# EAGLE design GiGaMega_uneversal_1 (EAGLE 7.1.0)

## Sheet 1 of 2
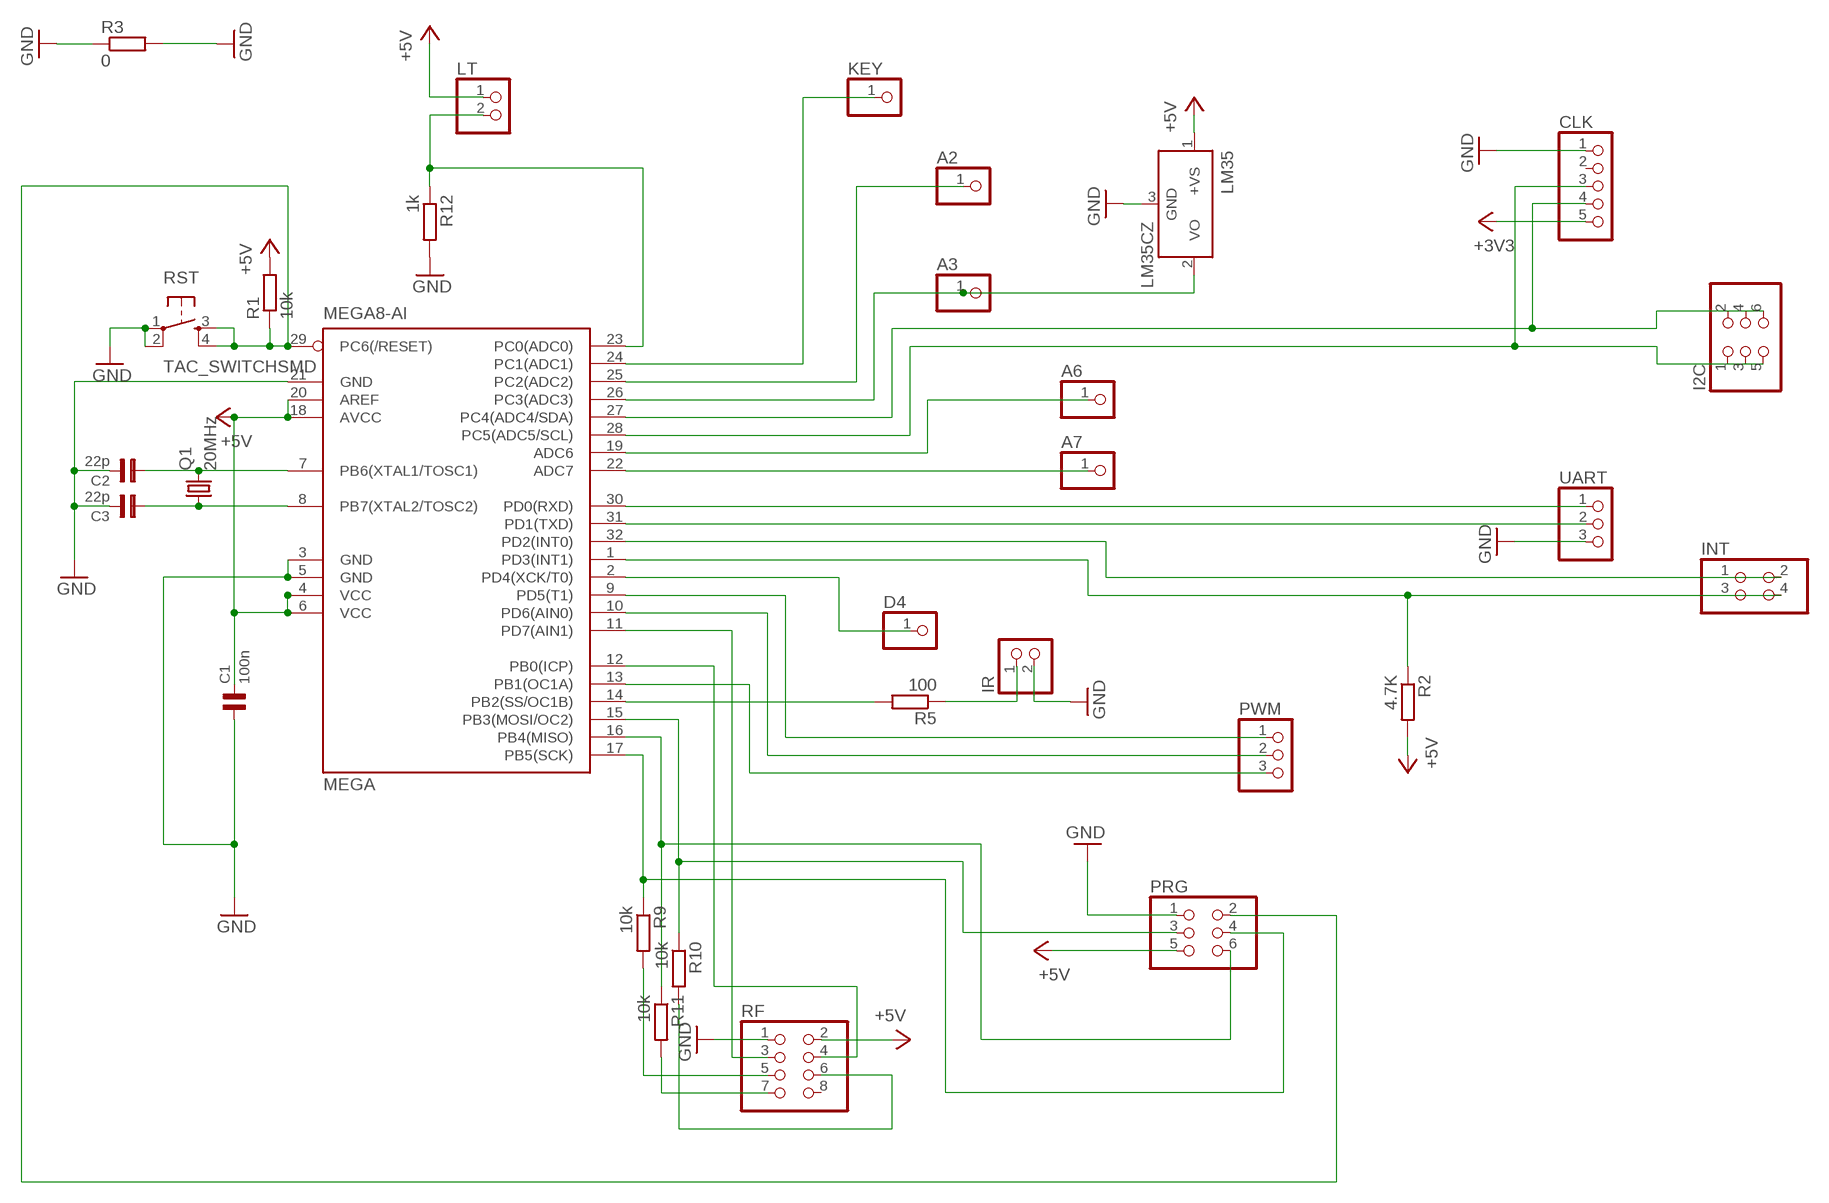
[diagram p0: schematic, sheet 1]

### Parts
A2  PINHD-1X1  [1X01]
A3  PINHD-1X1  [1X01]
A6  PINHD-1X1  [1X01]
A7  PINHD-1X1  [1X01]
C1  100n  C1206  [1206]
C2  22p  C1206  [1206]
C3  22p  C1206  [1206]
CLK  PINHD-1X5  [1X05]
D4  PINHD-1X1  [1X01]
I2C  PINHD-2X3  [2X03]
INT  PINHD-2X2  [2X02]
IR  PINHD-1X2  [1X02]
KEY  PINHD-1X1  [1X01]
LM35  LM35CZ  [TO92]
LT  PINHD-1X2  [1X02]
MEGA  MEGA8-AI  [TQFP32-08]
PRG  PINHD-2X3  [2X03]
PWM  PINHD-1X3  [1X03]
Q1  20MHz  CRYSTALHC49UP  [HC49UP]
R1  10k  R-EU_R1206  [R1206]
R2  4.7K  R-EU_R1206  [R1206]
R3  0  R-EU_R1206  [R1206]
R5  100  R-EU_R1206  [R1206]
R9  10k  R-EU_R1206  [R1206]
R10  10k  R-EU_R1206  [R1206]
R11  10k  R-EU_R1206  [R1206]
R12  1k  R-EU_R1206  [R1206]
RF  PINHD-2X4  [2X04]
RST  TAC_SWITCHSMD  [TACTILE-SWITCH-SMD]
UART  PINHD-1X3  [1X03]

### Nets
+3V3: CLK.5 ; also sheet 2
+5V: C1.2 LM35.1(+VS) LT.1 MEGA.4(VCC) MEGA.6(VCC) MEGA.18(AVCC) MEGA.20(AREF) PRG.5 R1.2 R2.2 RF.2 ; also sheet 2
GND: C1.1 C2.2 C3.2 CLK.1 IR.2 LM35.3(GND) MEGA.3(GND) MEGA.5(GND) MEGA.21(GND) PRG.1 R3.1 R3.2 R12.2 RF.1 RST.1 RST.2 UART.3 ; also sheet 2
KEY_PIN24: KEY.1 MEGA.24(PC1(ADC1))
MISO: MEGA.16(PB4(MISO)) PRG.6 R11.1
MOSI: MEGA.15(PB3(MOSI/OC2)) PRG.3 R10.1
N$1: A2.1 MEGA.25(PC2(ADC2))
N$2: D4.1 MEGA.2(PD4(XCK/T0))
N$4: INT.3 INT.4 MEGA.1(PD3(INT1)) R2.1
N$24: R10.2 RF.6
N$25: R11.2 RF.7
N$30: R9.2 RF.5
PIN1_IRLED: IR.1 R5.1
PIN2: MEGA.9(PD5(T1)) PWM.1
PIN7: C2.1 MEGA.7(PB6(XTAL1/TOSC1)) Q1.2
PIN8: C3.1 MEGA.8(PB7(XTAL2/TOSC2)) Q1.1
PIN9: MEGA.10(PD6(AIN0)) PWM.2
PIN10: MEGA.13(PB1(OC1A)) PWM.3
PIN11: MEGA.11(PD7(AIN1)) RF.3
PIN12: MEGA.12(PB0(ICP)) RF.4
PIN14: MEGA.14(PB2(SS/OC1B)) R5.2
PIN19: A6.1 MEGA.19(ADC6)
PIN22: A7.1 MEGA.22(ADC7)
PIN23: LT.2 MEGA.23(PC0(ADC0)) R12.1
PIR_: A3.1 LM35.2(VO) MEGA.26(PC3(ADC3))
PIR_WATER: INT.1 INT.2 MEGA.32(PD2(INT0))
RESET: MEGA.29(PC6(/RESET)) PRG.2 R1.1 RST.3 RST.4
RX: MEGA.30(PD0(RXD)) UART.1
SCK: MEGA.17(PB5(SCK)) PRG.4 R9.1
SCL: CLK.3 I2C.1 I2C.3 I2C.5 MEGA.28(PC5(ADC5/SCL))
SDA: CLK.4 I2C.2 I2C.4 I2C.6 MEGA.27(PC4(ADC4/SDA))
TX: MEGA.31(PD1(TXD)) UART.2
Unconnected: CLK.2 RF.8

## Sheet 2 of 2
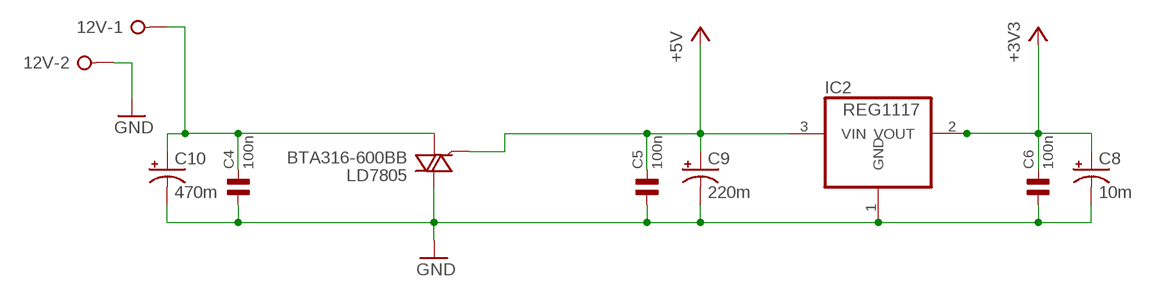
[diagram p1: schematic, sheet 2]

### Parts
12V  W237-02P  [W237-132]
C4  100n  C1206  [1206]
C5  100n  C1206  [1206]
C6  100n  C1206  [1206]
C8  10m  CPOL-USUD-4X5,8  [UD-4X5,8_NICHICON]
C9  220m  CPOL-USUD-6,3X7,7  [UD-6,3X7,7_NICHICON]
C10  470m  CPOL-USUD-10X10  [UD-10X10_NICHICON]
IC2  REG1117  [SOT223]
LD7805  BTA316-600BB  [SOT404]

### Nets
+3V3: C6.2 C8.+ IC2.2(VOUT) ; also sheet 1
+5V: C5.2 C9.+ IC2.3(VIN) LD7805.3(G) ; also sheet 1
+12: 12V.1 C4.2 C10.+ LD7805.1(CM)
GND: 12V.2 C4.1 C5.1 C6.1 C8.- C9.- C10.- IC2.1(GND) LD7805.MB(LD) ; also sheet 1

## Library data of the parts
12V = con-wago-508:W237-02P: WAGO SREW CLAMP; OC_FARNELL: unknown; OC_NEWARK: unknown
A2 A3 A6 A7 D4 KEY = pinhead:PINHD-1X1: PIN HEADER
C1-C6 = capsmd:C1206
C8-C10 = rcl:CPOL-US: POLARIZED CAPACITOR, American symbol
CLK = pinhead:PINHD-1X5: PIN HEADER
I2C PRG = pinhead:PINHD-2X3: PIN HEADER
IC2 = burr-brown:REG1117: 800mA and 1A Low Dropout (LDO) Positive Regulator 1.8V, 2.5V, 2.85V, 3.3V, 5V, and Adj; MPN: REG1117; OC_FARNELL: 1097566; OC_NEWARK: 14P6981
INT = pinhead:PINHD-2X2: PIN HEADER
IR LT = pinhead:PINHD-1X2: PIN HEADER
LD7805 = nxp_60:BTA316: Planar passivated high commutation three quadrant triac in a SOT78 plastic package intended for use in circuits where high static and dynamic dV/dt and high dI/dt can occur AAL Eindhoven MV+ MK; 12NC: 9340 601 04118
LM35 = lm35:LM35: Single-Supply Centigrade Temperature Sensor Vout = (10mV/°C x Temp °C) +5mmmV Source: http://www.national.com/ds/LM/LM35.pdf
MEGA = atmel:MEGA8: MICROCONTROLLER 8 Kbytes FLASH, 1 kbytes SRAM, 512 bytes EEPROM, USART, 6-channel 10 bit ADC, 2-channel 8 bit ADC Pin compatible with Atmega48, ATMega88, ATMega168 Source: avr.lbr; MPN: ATMEGA8-16AU; OC_FARNELL: 9171371; OC_NEWARK: 73M8863
PWM UART = pinhead:PINHD-1X3: PIN HEADER
Q1 = crystal:CRYSTAL: CRYSTAL; OC_FARNELL: unknown; OC_NEWARK: unknown
R1-R3 R5 R9-R12 = rcl:R-EU_: RESISTOR, European symbol
RF = pinhead:PINHD-2X4: PIN HEADER
RST = SparkFun-Retired:TAC_SWITCH: Momentary Switch Button commonly used for reset or general input. Spark Fun Electronics SKU : COM-00097 SMT- SWCH-08247; PROD_ID: SWCH-08247

## Board
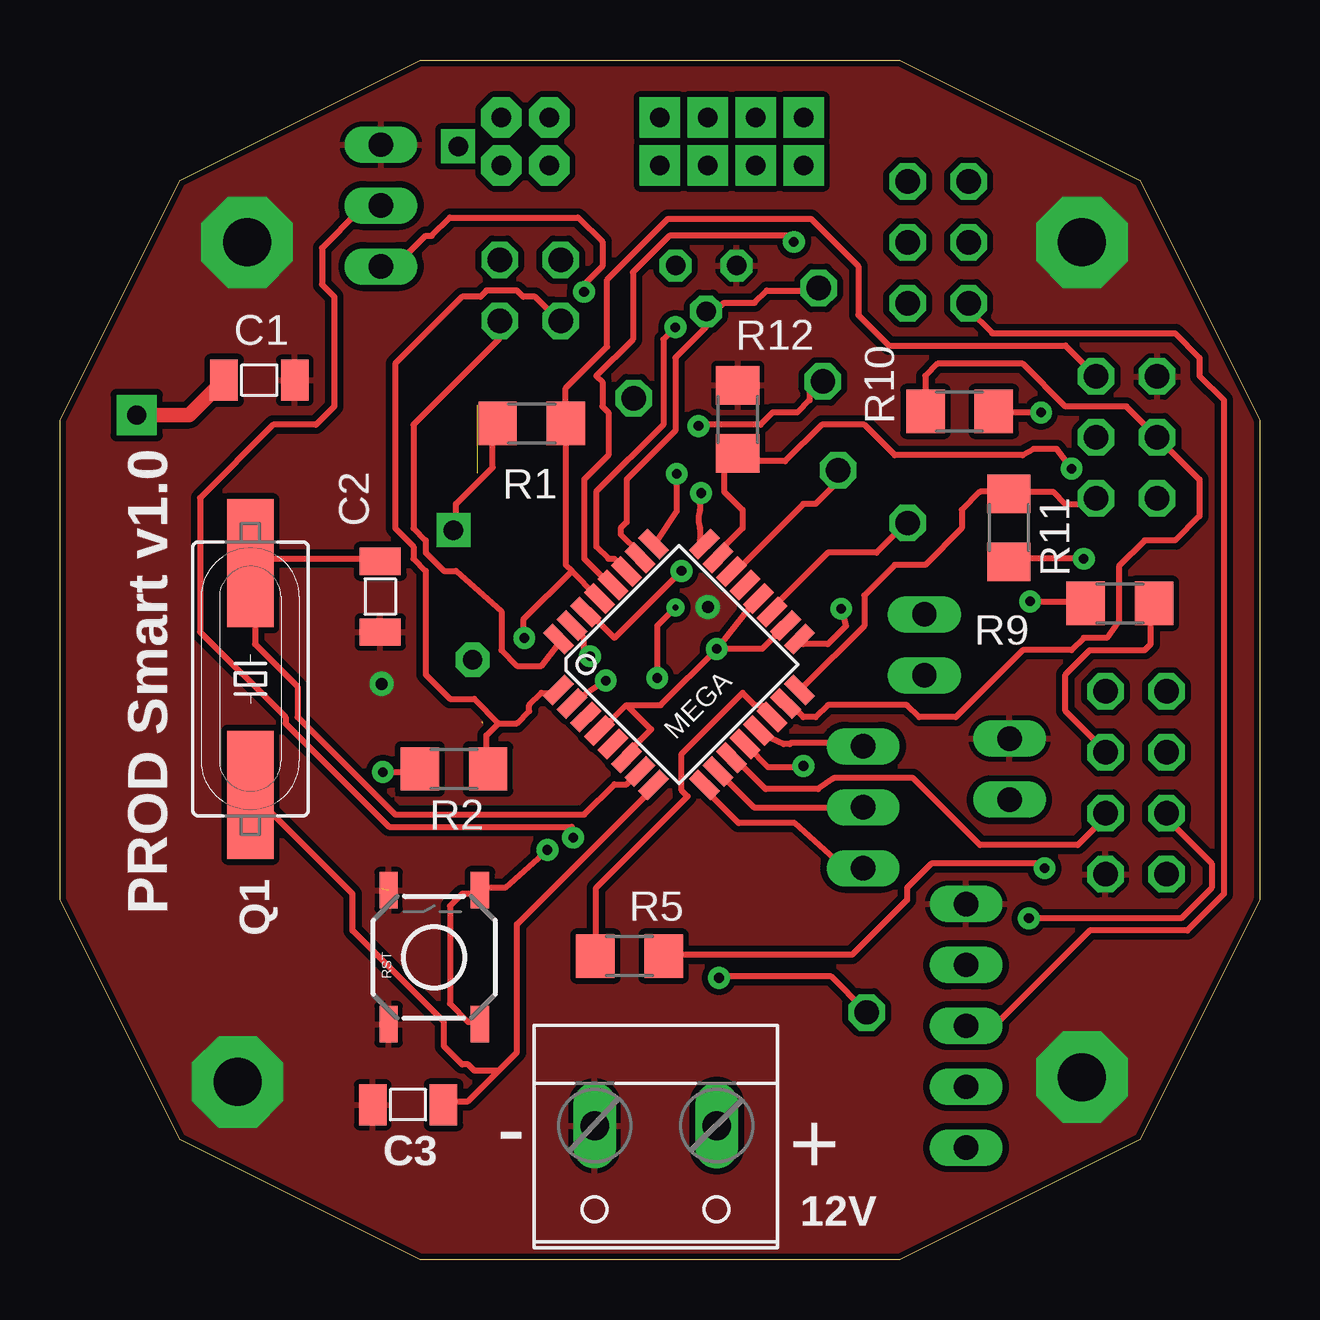
[diagram p2: board, top side]
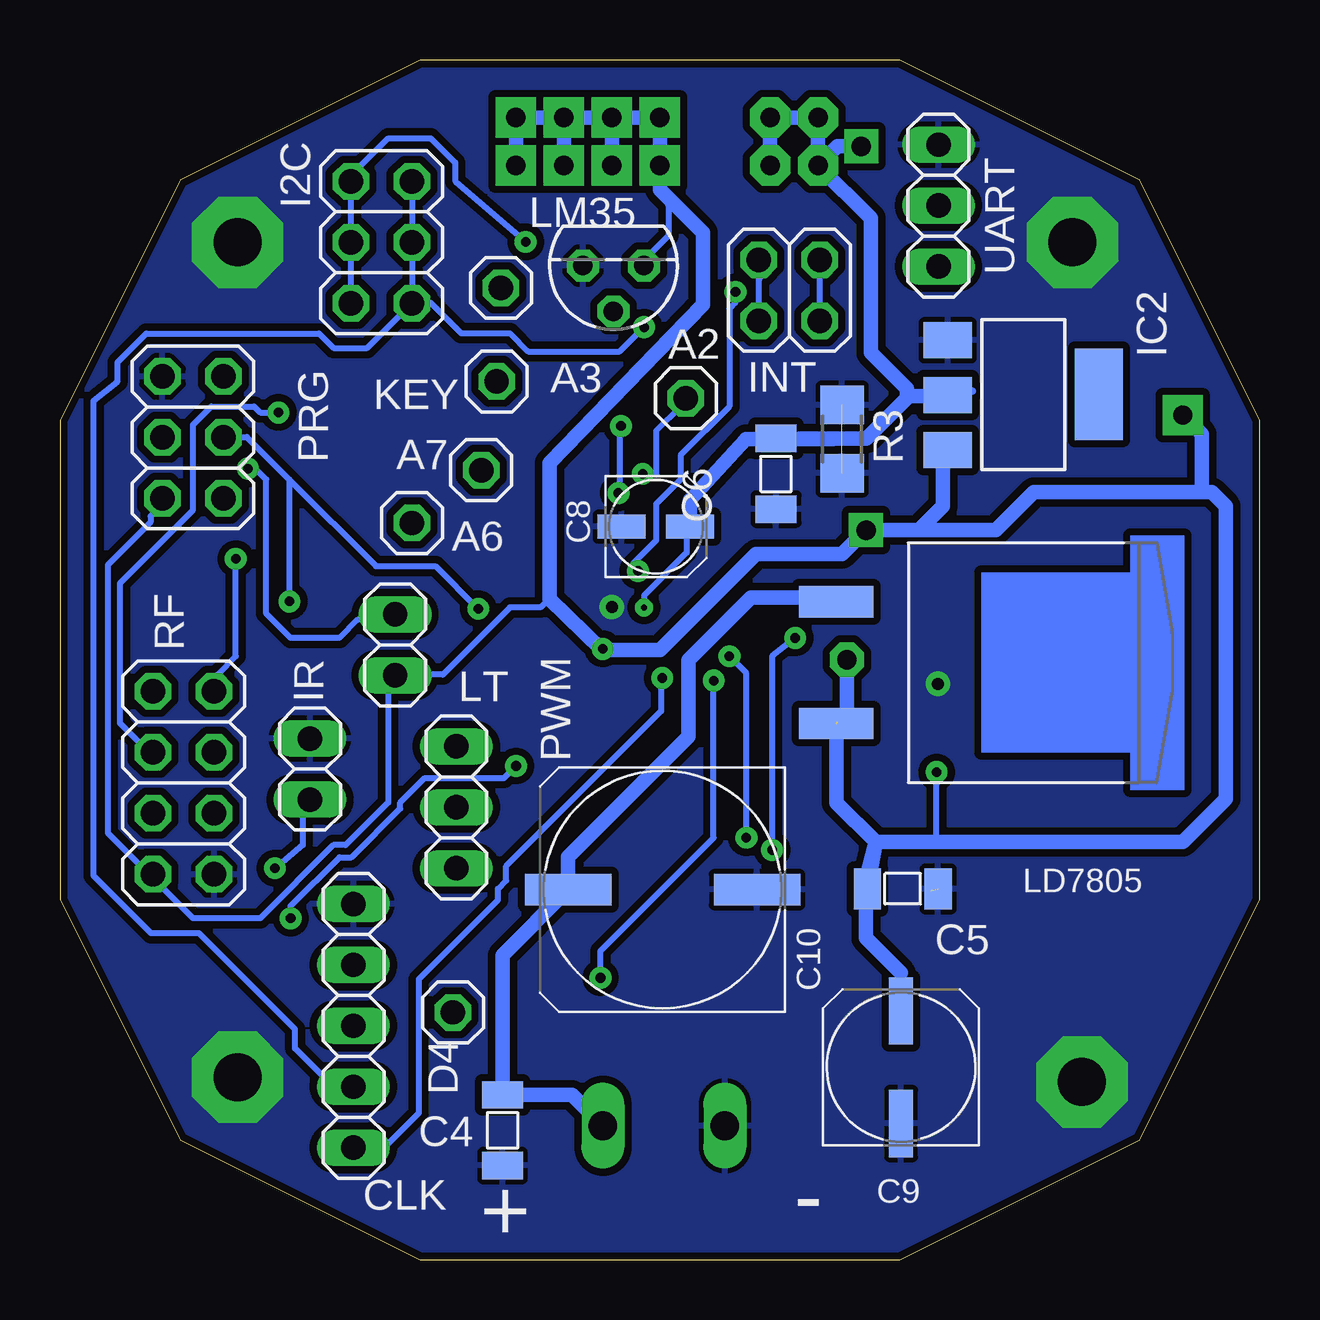
[diagram p3: board, bottom side, seen from below]

Size 50 x 50 mm. Coordinates in mm from the lower left corner, seen from the top.
Outline: 5,45 15,50 35,50 45,45 50,35 50,15 45,5 35,0 15,0 5,5 0,15 0,35 5,45
Copper layers (1*16): Top 0.035mm / dielectric 1.5mm / Bottom 0.035mm
Design rules "default *": minimum track width 10mil, minimum drill 10mil, track to track 10mil, track to pad 10mil, pad to pad 8mil, via to via 10mil, smd to smd 10mil, copper to edge 10mil, drill to drill 10mil, minimum pad ring 10mil, minimum via ring 10mil, stop-mask expansion 10mil, vias tented up to drill 10mil, thermal gap 8mil

### Footprints (pad centres in the part's own frame; a part is rotated, then mirrored left to right if it is on the bottom)
W237-132 = drill 1.194 long: 1 -2.54,-0.635; 2 2.54,-0.635
1X01 = drill 1.016 octagon: 1 0,0
1206 = smd 1.143 x 1.702: 1 -1.473,0; 2 1.473,0
UD-4X5,8_NICHICON = smd 2 x 1: + 1.425,0; - -1.425,0
UD-6,3X7,7_NICHICON = smd 2.8 x 1: + 2.35,0; - -2.35,0
UD-10X10_NICHICON = smd 3.6 x 1.3: + 3.925,0; - -3.95,0
1X05 = drill 1.016 long: 1 -5.08,0; 2 -2.54,0; 3 0,0; 4 2.54,0; 5 5.08,0
2X03 = drill 1.016 octagon: 1 -2.54,-1.27; 2 -2.54,1.27; 3 0,-1.27; 4 0,1.27; 5 2.54,-1.27; 6 2.54,1.27
SOT223 = smd 1.499 x 2.007: 1 -2.261,-3.15; 2 0.025,-3.15; 3 2.311,-3.15 | smd 3.81 x 2.007: 4 0,3.15
2X02 = drill 1.016 octagon: 1 -1.27,-1.27; 2 -1.27,1.27; 3 1.27,-1.27; 4 1.27,1.27
1X02 = drill 1.016 long: 1 -1.27,0; 2 1.27,0
SOT404 = smd 1.3 x 3.1: 1 -2.54,-6.35; 3 2.54,-6.35 | smd 0 x 0: MB 0,0
TO92 = drill 0.813 octagon: 1 -1.27,0; 2 0,1.905; 3 1.27,0
TQFP32-08 = smd 1.27 x 0.559: 1 -4.293,2.8; 2 -4.293,2; 3 -4.293,1.2; 4 -4.293,0.4; 5 -4.293,-0.4; 6 -4.293,-1.2; 7 -4.293,-2; 8 -4.293,-2.8; 17 4.293,-2.8; 18 4.293,-2; 19 4.293,-1.2; 20 4.293,-0.4; 21 4.293,0.4; 22 4.293,1.2; 23 4.293,2; 24 4.293,2.8 | smd 0.559 x 1.27: 9 -2.8,-4.293; 10 -2,-4.293; 11 -1.2,-4.293; 12 -0.4,-4.293; 13 0.4,-4.293; 14 1.2,-4.293; 15 2,-4.293; 16 2.8,-4.293; 25 2.8,4.293; 26 2,4.293; 27 1.2,4.293; 28 0.4,4.293; 29 -0.4,4.293; 30 -1.2,4.293; 31 -2,4.293; 32 -2.8,4.293
1X03 = drill 1.016 long: 1 -2.54,0; 2 0,0; 3 2.54,0
HC49UP = smd 5.334 x 1.93: 1 -4.826,0; 2 4.826,0
R1206 = smd 1.6 x 1.803: 1 -1.422,0; 2 1.422,0
2X04 = drill 1.016 octagon: 1 -3.81,-1.27; 2 -3.81,1.27; 3 -1.27,-1.27; 4 -1.27,1.27; 5 1.27,-1.27; 6 1.27,1.27; 7 3.81,-1.27; 8 3.81,1.27
TACTILE-SWITCH-SMD = smd 1.524 x 0.762: 1 -2.794,1.905; 2 2.794,1.905; 3 -2.794,-1.905; 4 2.794,-1.905

### Placement (x,y rotation side)
12V  24.83,4.94 180 top
A2  23.91,35.9 0 bottom
A3  31.62,40.5 0 bottom
A6  35.33,30.7 0 bottom
A7  32.44,32.9 0 bottom
C1  8.31,36.65 180 top
C2  13.35,27.63 270 top
C3  14.51,6.45 180 top
C4  31.55,5.39 90 bottom
C5  14.87,15.45 180 bottom
C6  20.15,32.75 90 bottom
C8  25.16,30.55 0 bottom
C9  14.94,8.02 90 bottom
C10  24.89,15.42 180 bottom
CLK  37.77,9.74 270 bottom
D4  33.62,10.3 0 bottom
I2C  36.6,42.4 270 bottom
IC2  9.85,36.06 270 bottom
INT  19.6,40.4 180 bottom
IR  39.58,20.44 90 bottom
KEY  31.8,36.6 0 bottom
LD7805  11.29,24.88 270 bottom
LM35  26.93,41.43 180 bottom
LT  36.03,25.62 90 bottom
MEGA  25.8,24.8 45 top
PRG  44.46,34.27 270 bottom
PWM  33.48,18.85 90 bottom
Q1  7.94,24.2 90 top
R1  19.66,34.85 180 top
R2  16.42,20.45 180 top
R3  17.4,34.2 270 bottom
R5  23.74,12.65 180 top
R9  44.18,27.35 0 top
R10  37.5,35.35 0 top
R11  39.55,30.5 270 top
R12  28.25,35.02 90 top
RF  44.85,19.87 90 bottom
RST  15.6,12.6 90 top
UART  13.38,43.93 90 bottom

### Tracks (layer width: path | path; a pad name or v marks a point on that pad's centre or on a via)
+3V3  (via drill 0.25, 0.4, 0.8 pad 1.42, 0.8 pad 1.68)
  Top 0.254: v24.89,24.24 24.89,26.42 v25.65,27.18
  Bottom 0.254: v24.89,24.24 24.95,24.18 24.95,22.86 31.4,16.41 31.4,15.8 31.75,15.45 31.75,14.99 35.05,11.68 35.05,6.1 36.32,4.83 37.59,4.83 CLK.5 | v25.65,27.18 25.65,27.69 23.88,29.46 23.88,30.48 C8.+
  Bottom 0.305: 17.82,34.15 C6.2 | C6.2 19.18,34.22 | 11.96,36.2 IC2.2 | 17.77,34.2 C6.2
  Bottom 0.61: C8.+ 23.73,31.66 21.4,34.2 17.77,34.2 | 19.18,34.22 16.38,34.22 14.7,35.9 | 14.7,35.9 14.6,36 13.03,36 IC2.2 | v20.4,45.6 v20.4,47.6 v18.4,47.6 v18.4,45.6 | v16.6,46.4 17.6,46.4 v18.4,45.6 | v18.4,45.6 16.2,43.4 16.2,37.8 14.7,36.3 14.7,35.9
+5V  (via drill 0.4, 0.8 pad 1.42, 0.8 pad 1.68)  (1 unrouted)
  Top 0.254: 23.62,23.11 22.61,22.1 MEGA.4 | 23.62,23.11 24.64,22.1 23.88,21.34 23.88,21.08 23.62,21.08 MEGA.6 | v27.38,25.45 28.96,27.43 MEGA.20 | MEGA.18 30.23,26.42 29.26,25.45 v27.38,25.45 | v13.46,20.32 14.99,20.32 R2.2 | R1.2 18.03,34.8 18.03,33.02 16.51,31.5 16.51,30.48 v16.4,30.4 | 23.62,23.11 25.04,23.11 v27.38,25.45
  Top 0.61: v3.2,35.2 5.39,35.2 C1.2
  Bottom 0.254: PRG.5 45.97,31.5 45.97,31.24 46.23,30.99 46.23,30.73 48.01,28.96 48.01,17.78 46.74,16.51 46.74,16.26 46.23,16.26 RF.2 45.97,16 45.72,15.75 45.72,15.49 44.45,14.22 41.66,14.22 38.61,17.27 38.1,17.27 36.32,19.05 36.32,23.88 36.07,24.13 LT.1 35.81,24.38 34.04,24.38 31.24,27.18 29.97,27.18 29.41,27.74 29.59,27.53 | 13.46,17.4 v13.46,20.32 | LM35.1 25.65,41.66 24.64,42.67 24.64,43.94 24.49,44.09 | v27.38,25.45 27.4,25.4
  Bottom 0.305: 14.94,11.94 C9.+ | 16.4,15.39 C5.2
  Bottom 0.61: 14.94,11.94 16.4,13.4 16.4,15.39 | LD7805.3 17.64,19.04 16,17.4 16.4,15.79 C5.2 15.99,17.4 13.46,17.4 3.2,17.4 1.4,19.2 1.4,31.4 2,32 2.4,32 | v16.4,30.4 14.2,30.4 13.2,31.4 13.2,33.55 IC2.3 | v16.4,30.4 11,30.4 9.4,32 2.4,32 | v3.2,35.2 2.4,34.4 2.4,32 | v31,45.6 v31,47.6 v29,47.6 | v29,47.6 v29,45.6 | v29,47.6 v27,47.6 | v27,47.6 v27,45.6 | v27,47.6 v25,47.6 v25,45.6 25,44.6 24.49,44.09 23.2,42.8 23.2,39.8 29.6,33.2 29.6,28.6 29.59,27.53 27.4,25.4 25,25.4 21,29.4 17.4,29.4 v16.4,30.4 | 17.6,22.4 17.2,22.4 17.2,25
+12
  Bottom 0.305: 17.82,27.6 LD7805.1
  Bottom 0.61: 12V.1 28.66,6.86 C4.2 31.55,12.69 C10.+ 28.82,16.79 23.8,21.8 23.8,25 21.2,27.6 17.82,27.6
GND  (via drill 0.5 pad 0.3, 2 pad 3.81)  (2 unrouted)
  other vias: 7.8,42.4 42.6,42.4 42.6,7.6 7.4,7.4 13.4,24 27,27.2
  pour Top: 15,0 5,5 0,15 0,35 5,45 15,50 35,50 45,45 50,35 50,15 45,5 35,0
  pour Bottom (isolate 0.305): 15,0 5,5 0,15 0,35 5,45 15,50 35,50 45,45 50,35 50,15 45,5 35,0
KEY_PIN24  (via drill 0.4)
  Top 0.254: v26.72,31.95 26.67,31.5 26.67,31.24 26.62,30.99 26.62,30.73 26.67,30.48 26.67,29.97 MEGA.24 | KEY.1 31.75,36.58 31.24,36.58 31.24,35.81 30.73,35.31 29.71,35.31 29.2,34.8 26.67,34.8 v26.62,34.74
  Bottom 0.254: v26.72,31.95 26.67,32 26.67,34.29 v26.62,34.74
MISO
  Top 0.254: MEGA.16 30.99,23.88 33.53,26.42 33.53,27.69 34.8,28.96 36.07,28.96 37.59,30.48 37.59,31.24 38.35,32 39.37,32 R11.1 39.62,32 41.4,32 41.91,31.5 43.18,31.5 PRG.6
MOSI
  Top 0.254: MEGA.15 30.48,23.11 30.99,22.61 31.5,22.61 32,23.11 35.31,23.11 35.81,22.61 37.34,22.61 40.13,25.4 42.16,25.4 42.67,25.91 43.63,25.91 44.14,26.62 44.14,28.9 45.21,29.97 46.48,29.97 47.5,30.99 47.5,32.51 46.23,33.78 46.23,34.04 45.97,34.04 PRG.3 45.72,34.29 44.45,35.56 41.91,35.56 40.13,37.34 36.58,37.34 36.07,36.83 36.07,35.56 R10.1
N$1  (via drill 0.4)
  Top 0.254: v25.71,32.75 25.71,31.19 24.89,29.97 MEGA.25
  Bottom 0.254: v25.71,32.75 25.15,32.71 25.15,34.54 24.13,35.56 24.13,35.81 A2.1
N$2  (via drill 0.4)
  Top 0.254: v22.75,24.13 21.59,23.37 MEGA.2 | v27.47,11.74 27.52,11.79 32.15,11.79 33.53,10.41 33.58,10.41 D4.1
  Bottom 0.254: v22.75,24.13 22.75,17.58 27.47,12.86 v27.47,11.74
N$3  (via drill 0.8 pad 1.42)
  other vias: 17.2,25
N$4
  Top 0.254: 18.29,22.35 19.05,22.35 19.56,22.86 19.56,23.11 20.07,23.62 20.57,23.62 MEGA.1 | 18.29,22.35 17.78,21.84 17.78,20.57 R2.1 | 18.29,22.35 17.27,23.37 16.26,23.37 15.24,24.38 15.24,28.7 14.73,29.21 14.73,29.72 13.97,30.48 13.97,37.34 16.76,40.13 17.53,40.13 17.78,40.39 19.05,40.39 19.3,40.13 19.81,40.13 20.57,39.37 20.83,39.37 INT.4
  Bottom 0.254: INT.3 20.83,41.66 20.83,40.89 20.87,40.85 INT.4
N$24  (via drill 0.4)
  Top 0.254: v40.89,35.31 39.12,35.31 R10.2
  Bottom 0.254: v40.89,35.31 41.66,35.31 41.91,35.56 43.69,35.56 44.45,34.8 44.45,31.24 47.5,28.19 47.5,22.35 46.23,21.08 RF.6
N$25  (via drill 0.4)
  Top 0.254: v42.67,29.21 39.62,29.21 R11.2
  Bottom 0.254: v42.67,29.21 42.67,25.15 43.43,24.38 43.43,23.88 RF.7
N$30
  Top 0.254: R9.2 45.47,27.18 45.47,25.65 45.21,25.4 42.93,25.4 41.91,24.38 41.91,22.86 43.43,21.34 RF.5
PIN1_IRLED  (via drill 0.4)
  Top 0.254: R5.1 25.4,12.7 33.02,12.7 35.31,14.99 35.31,15.49 36.32,16.51 40.84,16.51 v41.04,16.31
  Bottom 0.254: v41.04,16.31 39.88,17.27 39.88,18.8 39.62,19.05 IR.1
PIN2
  Top 0.254: MEGA.9 26.92,19.56 28.29,18.2 30.63,18.2 32.51,16.51 33.27,16.51 PWM.1
PIN7
  Top 0.254: MEGA.7 24.13,20.32 23.62,19.81 23.11,19.81 21.84,18.54 13.97,18.54 9.91,22.61 9.91,23.88 8.13,25.65 8.13,28.96 Q1.2 8.13,29.21 13.21,29.21 C2.1
PIN8
  Top 0.254: 18.29,7.87 17.02,6.6 16,6.6 C3.1 | 18.29,7.87 19.05,8.64 19.05,13.97 24.64,19.56 MEGA.8 | 18.29,7.87 17.27,7.87 17.02,8.13 16.76,8.13 16,8.89 16,9.91 12.19,13.72 12.19,15.24 8.13,19.3 Q1.1
PIN9
  Top 0.254: MEGA.10 28.92,18.85 PWM.2
PIN10
  Top 0.254: MEGA.13 29.41,21.84 30.17,21.48 30.43,21.48 30.48,21.54 33.27,21.54 PWM.3
PIN11
  Top 0.254: MEGA.11 28.19,20.83 29.41,19.61 31.6,19.61 32.26,20.07 35.56,20.07 38.35,17.27 42.42,17.27 43.69,18.54 RF.3
PIN12  (via drill 0.4)
  Top 0.254: v30.99,20.57 30.93,20.52 29.52,20.52 28.7,21.34 MEGA.12 | v40.39,14.22 46.74,14.22 48.01,15.49 48.01,16.51 45.97,18.54 RF.4
  Bottom 0.254: v40.39,14.22 40.39,14.73 38.35,16.76 37.85,16.76 35.81,18.8 35.81,19.05 34.8,20.07 31.5,20.07 v30.99,20.57
PIN14
  Top 0.254: MEGA.14 29.46,22.86 29.21,23.11 28.96,23.11 28.45,23.62 25.91,21.08 25.91,19.56 26.16,19.3 22.35,15.49 22.35,12.7 R5.2
PIN19
  Top 0.254: MEGA.19 29.72,27.18 32,29.46 34.04,29.46 35.05,30.48 35.31,30.48 A6.1
PIN22
  Top 0.254: MEGA.22 28.19,28.7 30.99,31.5 31.5,31.5 32.26,32.26 32.26,32.77 A7.1
PIN23  (via drill 0.4)
  Top 0.254: MEGA.23 27.43,29.21 27.69,29.46 27.69,29.72 28.45,30.48 28.45,31.24 27.69,32 27.69,33.02 R12.1 27.69,33.27 30.23,33.27 31.75,34.8 33.53,34.8 34.8,33.53 40.13,33.53 40.59,33.78 41.55,33.78 v42.16,32.97
  Bottom 0.254: v42.16,32.97 41.91,33.02 41.4,32.51 41.4,26.92 40.39,25.91 38.35,25.91 37.59,26.67 36.07,26.67 LT.2
PIR_
  Top 0.254: MEGA.26 24.13,29.46 23.37,30.23 23.37,30.48 23.62,30.73 23.62,32.51 25.65,34.54 25.65,37.59 26.92,38.86 26.92,39.37 LM35.2 27.33,39.52 27.69,39.88 28.96,39.88 29.46,40.39 31.5,40.39 A3.1
PIR_WATER
  Top 0.254: MEGA.32 20.83,25.65 20.77,25.65 20.07,24.75 19.05,24.75 18.4,25.4 18.4,27.02 16.51,28.7 16,28.7 15.24,29.46 15.24,29.97 14.73,30.48 14.73,34.8 18.29,38.35 18.29,39.12 INT.2
  Bottom 0.254: INT.2 INT.1
RESET  (via drill 0.4)
  Top 0.254: RST.3 17.27,9.91 17.02,9.91 16.26,10.67 16.26,14.73 16.76,15.24 17.27,15.24 RST.4 17.53,15.49 18.54,15.49 v20.32,17.07 | 21.34,28.7 21.08,28.96 R1.1 21.08,36.32 22.81,38.05 22.81,40.84 25.35,43.38 31.3,43.38 33.27,41.4 33.27,39.37 34.54,38.1 41.91,38.1 43.18,36.83 PRG.2 | 21.34,28.7 22.35,27.69 MEGA.29 | v19.36,25.91 19.3,26.16 19.3,26.67 21.34,28.7
  Bottom 0.254: v20.32,17.07 20.32,25.15 v19.36,25.91
RX  (via drill 0.4)
  Top 0.254: v25.91,28.7 23.11,25.91 22.1,26.92 MEGA.30 | v21.84,40.33 21.9,40.39 21.9,40.69 22.61,41.4 22.61,42.42 21.59,43.43 16.26,43.43 15.49,42.67 15.24,42.67 13.97,41.4 13.46,41.4 UART.1
  Bottom 0.254: v25.91,28.7 26.11,29.01 25.15,29.97 25.15,31.5 24.13,32.51 24.13,33.53 22.1,35.56 22.1,39.62 21.84,39.88 v21.84,40.33
SCK  (via drill 0.4)
  Top 0.254: v32.57,27.12 32.77,26.42 32,25.65 30.99,25.65 MEGA.17 | v40.44,27.43 42.67,27.43 R9.1
  Bottom 0.254: v32.57,27.12 34.34,28.9 36.83,28.9 40.44,32.51 | 40.44,32.51 42.22,34.29 43.18,34.29 PRG.4 | 40.44,32.51 v40.44,27.43
SCL  (via drill 0.4 pad 0.3)
  Top 0.254: v30.59,42.42 30.53,42.67 25.4,42.67 23.88,41.15 23.88,38.35 22.35,36.83 22.61,36.58 22.61,35.56 22.86,35.31 22.86,33.53 21.84,32.51 21.84,29.21 22.86,28.19 MEGA.28 | CLK.3 37.85,9.91 39.12,9.91 42.93,13.72 46.99,13.72 48.51,15.24 48.51,35.81 47.5,36.83 47.5,37.59 46.48,38.61 38.86,38.61 37.85,39.62 I2C.5
  Bottom 0.254: v30.59,42.42 33.53,44.96 33.53,45.72 34.54,46.74 36.32,46.74 37.85,45.21 37.85,44.96 I2C.1 I2C.3 I2C.5
SDA  (via drill 0.4)
  Top 0.254: v25.65,38.86 25.15,38.35 25.15,34.8 22.35,32 22.35,29.72 22.86,29.21 23.11,29.21 23.62,28.7 MEGA.27
  Bottom 0.254: v25.65,38.86 26.67,37.85 30.48,37.85 31.24,38.61 33.27,38.61 34.54,39.88 35.31,39.88 | 35.31,39.88 I2C.6 37.19,38 38.6,38 39.2,38.6 46.4,38.6 47.6,37.4 47.6,36.6 48.6,35.8 48.6,16 46.2,13.6 44.2,13.6 40.2,9.6 40.2,8.8 38.6,7.2 CLK.4 | 35.31,39.88 35.31,42.38 I2C.4 35.31,42.42 35.31,44.92 I2C.2
TX  (via drill 0.4)
  Top 0.254: v22.1,25.15 21.84,25.4 21.84,25.91 21.34,26.42 MEGA.31 | v21.39,17.58 21.34,18.03 13.72,18.03 9.4,22.35 9.4,22.61 5.84,26.16 5.84,31.75 8.89,34.8 10.67,34.8 11.43,35.56 11.43,40.13 10.92,40.64 10.92,42.16 12.45,43.69 13.21,43.69 UART.2
  Bottom 0.254: v22.1,25.15 21.39,24.44 v21.39,17.58

### Text on the board
tPlace: PROD Smart v1.0 | - | +
bPlace: - | +